# Altium schematic sheet G4y_SuperCap.SchDoc: Arduino and NFC
size A4; CheckedBy: D. Actis Grosso; Author: Simone C.; DocumentNumber: 1; Revision: 1.3; SheetNumber: 1; SheetTotal: 3
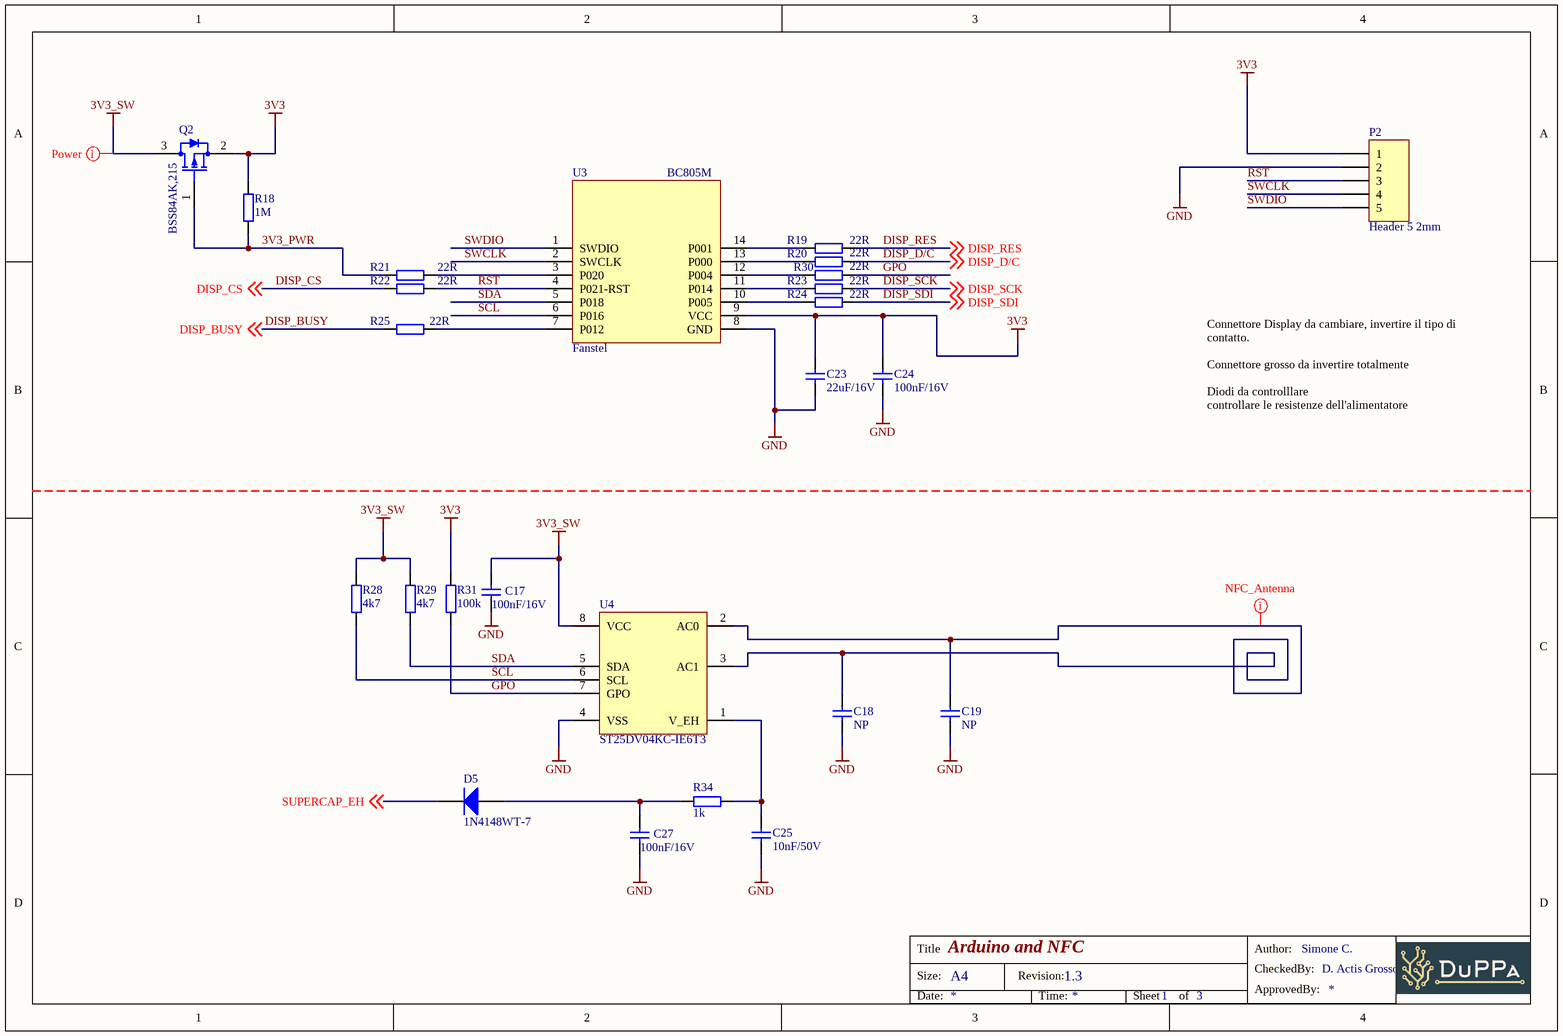
[diagram p0: G4y_SuperCap.SchDoc]

## Parts
C17  value 100nF/16V  [C0402]  (hidden comment: Cap_0402_100n/16V)
C18  value NP  [C0402]  (hidden comment: Cap_0402_NP)  (no BOM)
C19  value NP  [C0402]  (hidden comment: Cap_0402_NP)  (no BOM)
C23  value 22uF/16V  [C0805]  (hidden comment: Cap_0805_22uF/16V)
C24  value 100nF/16V  [C0402]  (hidden comment: Cap_0402_100n/16V)
C25  value 10nF/50V  [C0402]  (hidden comment: Cap_0402_10nF/50V)
C27  value 100nF/16V  [C0402]  (hidden comment: Cap_0402_100n/16V)
D5  PartNumber: 1N4148WT-7  [SODFL160X65-2N]  (hidden comment: Diode_1N4148WT)
P2  Header 5 2mm  [HDR1X5_2mm]  (no BOM)
Q2  PartNumber: BSS84AK,215  [SOT-23-3]  (hidden comment: BSS84AKBSS84AK,215)
R18  value 1M  [R0402]  (hidden comment: R_R0402_1M)
R19  value 22R  [R0402]  (hidden comment: R_R0402_22R)
R20  value 22R  [R0402]  (hidden comment: R_R0402_22R)
R21  value 22R  [R0402]  (hidden comment: R_R0402_22R)
R22  value 22R  [R0402]  (hidden comment: R_R0402_22R)
R23  value 22R  [R0402]  (hidden comment: R_R0402_22R)
R24  value 22R  [R0402]  (hidden comment: R_R0402_22R)
R25  value 22R  [R0402]  (hidden comment: R_R0402_22R)
R28  value 4k7  [R0402]  (hidden comment: R_R0402_4k7)
R29  value 4k7  [R0402]  (hidden comment: R_R0402_4k7)
R30  value 22R  [R0402]  (hidden comment: R_R0402_22R)
R31  value 100k  [R0402]  (hidden comment: R_R0402_100k)
R34  value 1k  [R0402]  (hidden comment: R_R0402_1k)
U3  Manufacturer: Fanstel  [BC805M]  (hidden comment: BLE Module)
U4  ST25DV04KC-IE6T3  [TSOP65P640X120-8N]

## Nets
3V3: C23.1 C24.1 P2.1 Q2.2(S) R18.2 R31.2 U3.9(VCC)
3V3_SW: C17.1 Q2.3(D) R28.1 R29.1 U4.8(VCC)
GND: C17.2 C18.2 C19.2 C23.2 C24.2 C25.2 C27.2 P2.2 U3.8(GND) U4.4(VSS)
3V3_PWR: Q2.1(G) R18.1 R21.1
DISP_BUSY: R25.1 ; off-sheet DISP_BUSY
DISP_CS: R22.1 ; off-sheet DISP_CS
DISP_D/C: R20.1 ; off-sheet DISP_D/C
DISP_RES: R19.1 ; off-sheet DISP_RES
DISP_SCK: R23.1 ; off-sheet DISP_SCK
DISP_SDI: R24.1 ; off-sheet DISP_SDI
GPO: R30.1 R31.1 U4.7(GPO)
RST: P2.3 R22.2 U3.4(P021-RST)
SCL: R28.2 U3.6(P016) U4.6(SCL)
SDA: R29.2 U3.5(P018) U4.5(SDA)
SUPERCAP_EH: D5.K ; off-sheet SUPERCAP_EH
SWCLK: P2.4 U3.2(SWCLK)
SWDIO: P2.5 U3.1(SWDIO)
NetC18_1: C18.1 C19.1 U4.2(AC0) U4.3(AC1)
NetC25_1: C25.1 R34.2 U4.1(V_EH)
NetC27_1: C27.1 D5.A R34.1
NetR19_2: R19.2 U3.14(P001)
NetR20_2: R20.2 U3.13(P000)
NetR21_2: R21.2 U3.3(P020)
NetR23_2: R23.2 U3.11(P014)
NetR24_2: R24.2 U3.10(P005)
NetR25_2: R25.2 U3.7(P012)
NetR30_2: R30.2 U3.12(P004)

## Layout directives
net class NFC_Antenna: NetC18_1
net class Power: 3V3_SW

## Notes on the sheet
- Connettore Display da cambiare, invertire il tipo di contatto.
  Connettore grosso da invertire totalmente
  Diodi da controlllare
  controllare le resistenze dell'alimentatore
- Title
- Size:
- A4
- Revision:
- Author:
- CheckedBy:
- Date:
- Time:
- Sheet
- of
- ApprovedBy:

## Library data of the parts
C17 C24 C27 = Cap_0402_100n/16V: 16V 100nF X7R ±10% 0402 Multilayer Ceramic Capacitors MLCC - SMD/SMT ROHS; PartNumber: CL05B104KO5NNNC; Manufacturer: Samsung Electro-Mechanics; Case/Package: 0402; LCSC: C1525; Voltage Rating: 16V; LCSC_Alt_1: C22435936; LCSC_Alt_2: C576716
C23 = Cap_0805_22uF/16V: 22uF ±20% 16V Ceramic Capacitor X5R 0805; PartNumber: CL21A226MOQNNNE; Manufacturer: Samsung Electro-Mechanics; Case/Package: 0805; LCSC: C98190; Voltage Rating: 16V; LCSC_Alt_1: C33546008; LCSC_Alt_2: C6119898
C25 = Cap_0402_10nF/50V: 10nF ±10% 50V Ceramic Capacitor X7R 0402; PartNumber: CL05B103KB5NNNC; Manufacturer: Samsung Electro-Mechanics; Case/Package: 0402; LCSC: C15195; LCSC_Alt_1: C6119808; LCSC_Alt_2: C5137480; Voltage Rating: 50V
D5 = Diode_1N4148WT: Diode Independent 80V 125mA Surface Mount SOD-523; Manufacturer: Diodes; Category: Rectifier Diodes; Case/Package: SOD-523; LCSC_Alt_1: C727112; LCSC_Alt_2: C5381437; LCSC: C83482
P2 = Header 5 2mm: Header, 5-Pin
Q2 = BSS84AKBSS84AK,215: P-Channel 50V 180mA 420mW Surface Mount SOT-23; Manufacturer: Nexperia; Category: MOSFETs; LCSC_Alt_1: C549760; LCSC_Alt_2: C7379993; LCSC: C127273
R18 = R_R0402_1M: 1MΩ ±1% 62.5mW 0402 Thick Film Resistor; PartNumber: 0402WGF1004TCE; Manufacturer: UNI-ROYAL; LCSC: C26083; Case/Package: 0402; LCSC_Alt_1: C2909328; LCSC_Alt_2: C2770623; Tolerance: 1%
R19-R25 R30 = R_R0402_22R: 22Ω ±1% 62.5mW 0402 Thick Film Resistor; PartNumber: 0402WGF220JTCE; Manufacturer: UNI-ROYAL; LCSC: C25092; Case/Package: 0402; LCSC_Alt_1: C49654869; LCSC_Alt_2: C2929994; Tolerance: 1%
R28 R29 = R_R0402_4k7: 0402, 1% ,63mW; PartNumber: 0402WGF4701TCE; LCSC: C25900; Case/Package: 0402
R31 = R_R0402_100k: 0402, 1% ,63mW; PartNumber: ERA-2VEB1003X; LCSC: C25741; Case/Package: 0402
R34 = R_R0402_1k: 0402, 1% ,63mW; PartNumber: 0402WGJ0102TCE; Manufacturer: UNI-ROYAL; LCSC: C25543; Case/Package: 0402; Tolerance: 1%
U3 = BC805M: Bluetooth Modules - 802.15.1 Bluetooth Low Energy, BLE 5.2 Module using Nordic nRF52805 SoC with integrated antenna; LCSC: C6751361; PartNumber: BC805M
U4 = ST25DV04KC-IE6T3: 53Kbit/s ISO 15693,NFC I2C TSSOP-8 RFID, RF Access, Monitoring ICs RoHS; Manufacturer: STMicroelectronics; Organization: 512X8; Case/Package: TSSOP; PartNumber: ST25DV04KC-IE6T3; LCSC_Alt_1: C5267455; LCSC: C5221719
C18 C19 = Cap_0402_NP: Case/Package: 0402